# Altium schematic sheet Sheet5.SchDoc
size A3; DocumentNumber: 5; SheetNumber: 5; SheetTotal: 7
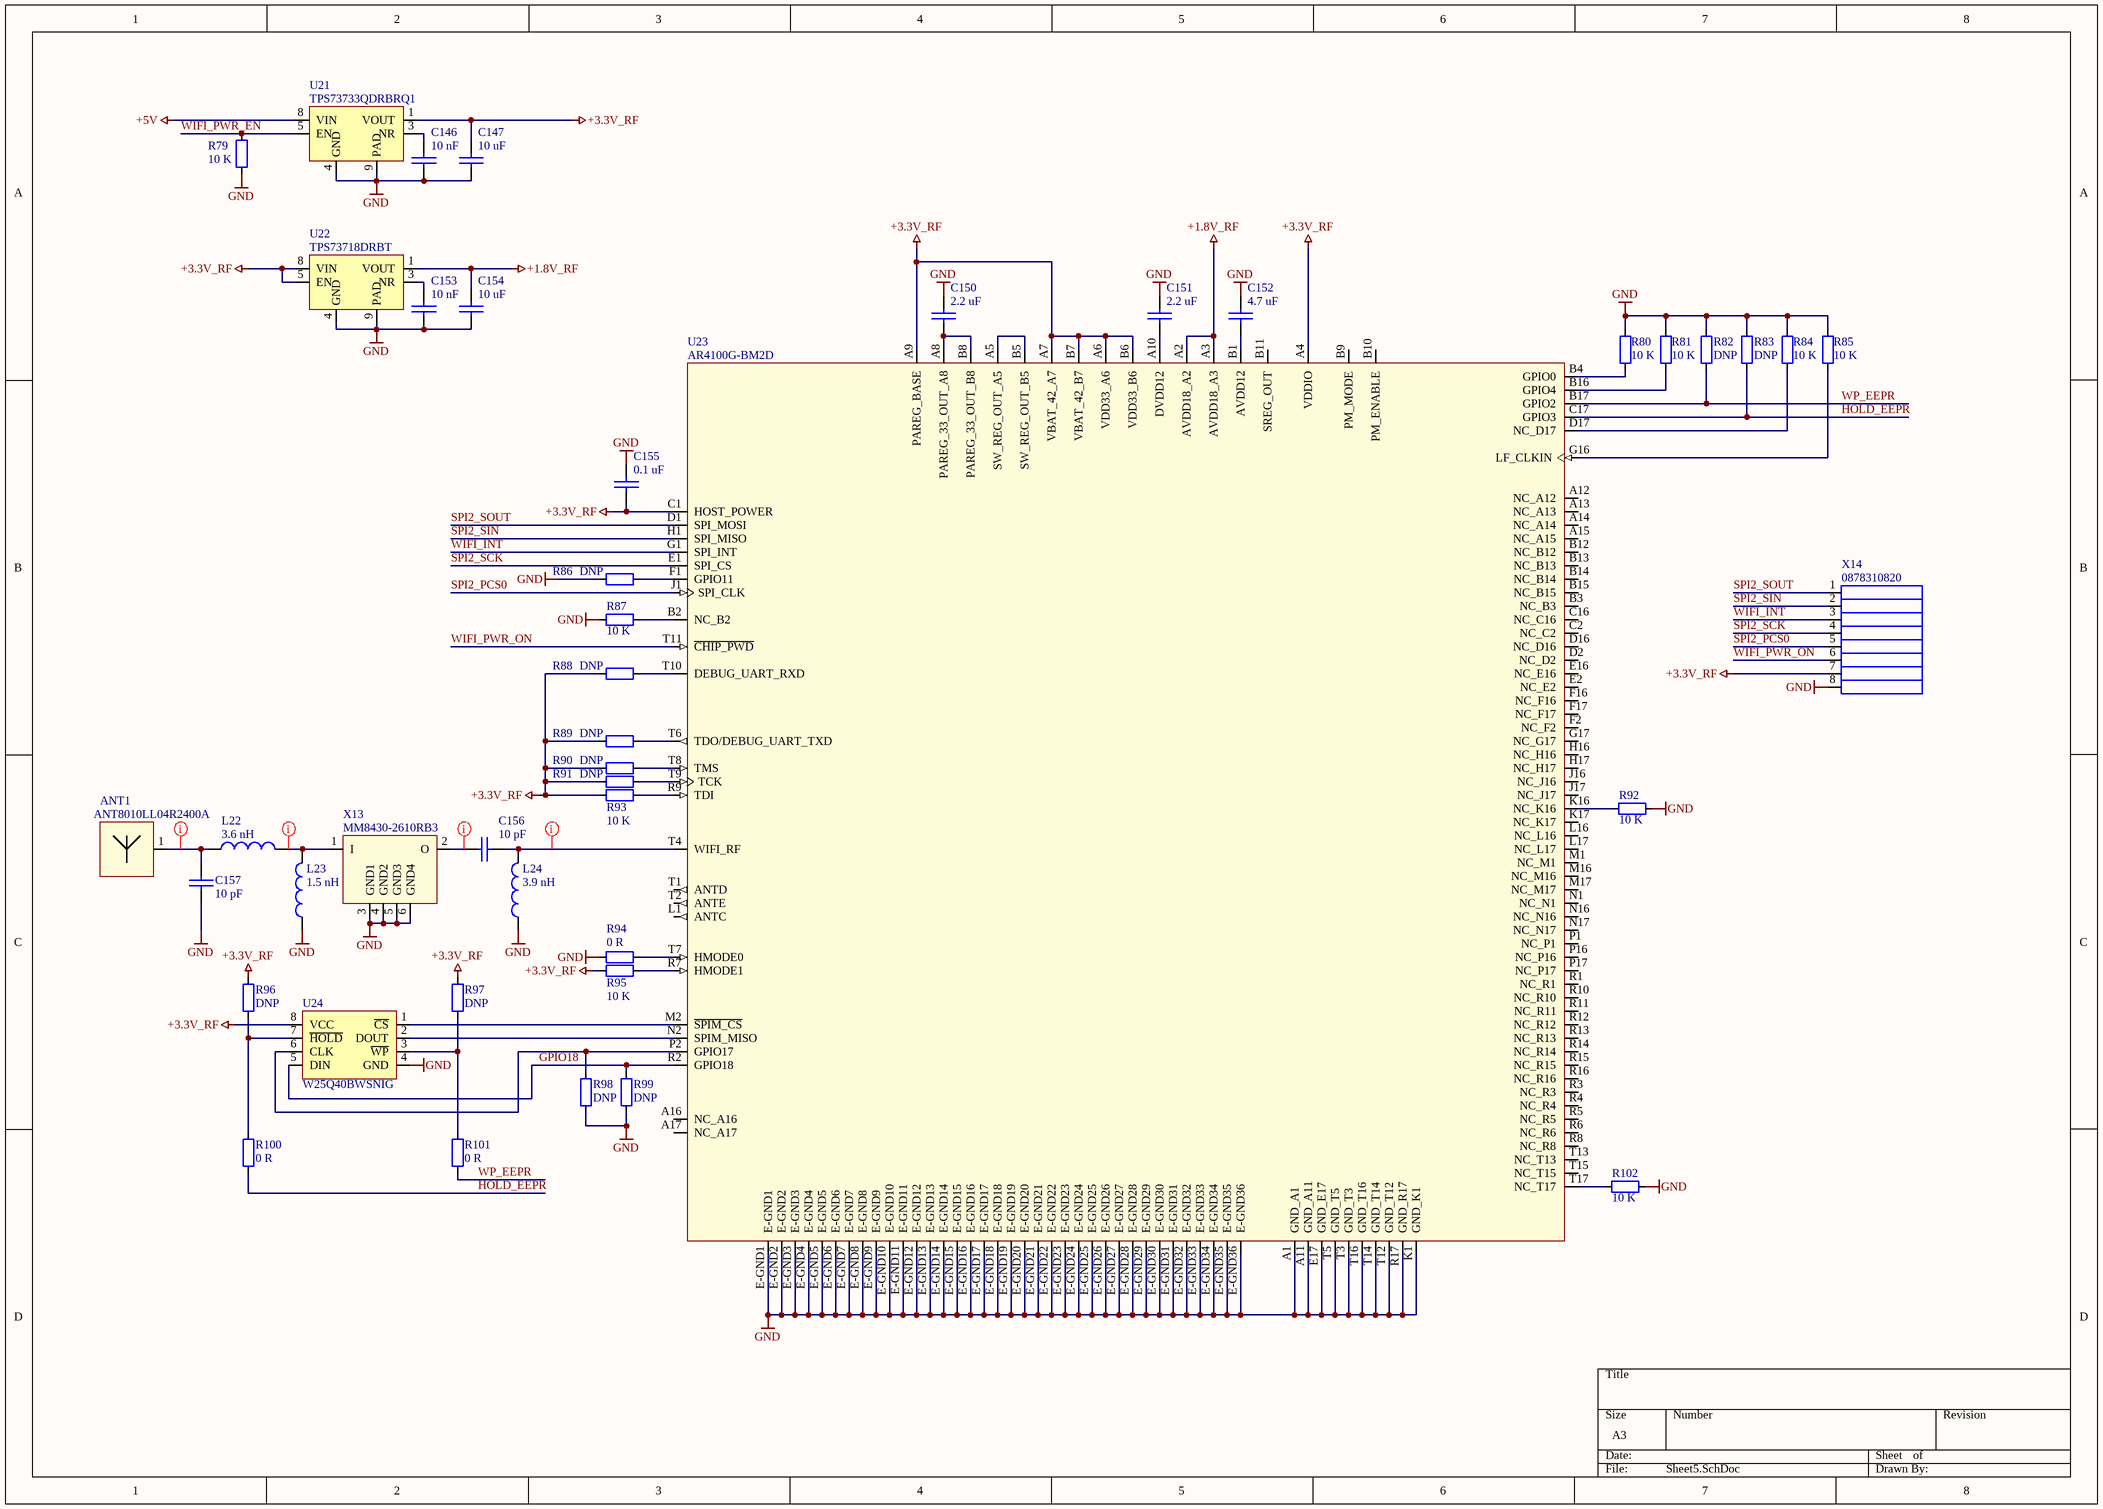
[diagram p0: Sheet5.SchDoc]

## Parts
ANT1  ANT8010LL04R2400A  [ANT8010LL04R2400A]
C146  value 10 nF  [1005[0402]]  (hidden comment: CL05B103KB5NNNC)
C147  value 10 uF  [2012[0805]]  (hidden comment: C2012X5R1C106K085AC)
C150  value 2.2 uF  [1005[0402]]  (hidden comment: C0402C225M9PACTU)
C151  value 2.2 uF  [1005[0402]]  (hidden comment: C0402C225M9PACTU)
C152  value 4.7 uF  [1608[0603]]  (hidden comment: LMK107BJ475KA-T)
C153  value 10 nF  [1005[0402]]  (hidden comment: CL05B103KB5NNNC)
C154  value 10 uF  [2012[0805]]  (hidden comment: CL05B104KO5NNNC)
C155  value 0.1 uF  [1005[0402]]  (hidden comment: CL05B104KO5NNNC)
C156  value 10 pF  [1005[0402]]  (hidden comment: GRM1555C1H100JZ01D)
C157  value 10 pF  [1005[0402]]  (hidden comment: GRM1555C1H100JZ01D)
L22  value 3.6 nH  [INDC1005-0402]  (hidden comment: LQP15MN3N6B02D)
L23  value 1.5 nH  [INDC1005-0402]  (hidden comment: LQP15MN1N5B02D)
L24  value 3.9 nH  [INDC1005-0402]  (hidden comment: LQP15MN3N9B02D)
R79  value 10 K  [0603]  (hidden comment: ERJ-3EKF1002V)
R80  value 10 K  [0402]  (hidden comment: ERJ-3EKF1002V)
R81  value 10 K  [0402]  (hidden comment: ERJ-3EKF1002V)
R82  value DNP  [0603]  (hidden comment: DNP_0603)  (no BOM)
R83  value DNP  [0603]  (hidden comment: DNP_0603)  (no BOM)
R84  value 10 K  [0402]  (hidden comment: ERJ-3EKF1002V)
R85  value 10 K  [0402]  (hidden comment: ERJ-3EKF1002V)
R86  value DNP  [0603]  (hidden comment: DNP_0603)  (no BOM)
R87  value 10 K  [0402]  (hidden comment: ERJ-3EKF1002V)
R88  value DNP  [0603]  (hidden comment: DNP_0603)  (no BOM)
R89  value DNP  [0603]  (hidden comment: DNP_0603)  (no BOM)
R90  value DNP  [0603]  (hidden comment: DNP_0603)  (no BOM)
R91  value DNP  [0603]  (hidden comment: DNP_0603)  (no BOM)
R92  value 10 K  [0402]  (hidden comment: ERJ-3EKF1002V)
R93  value 10 K  [0402]  (hidden comment: ERJ-3EKF1002V)
R94  value 0 R  [0603]  (hidden comment: RC0603JR-070RL)
R95  value 10 K  [0402]  (hidden comment: ERJ-3EKF1002V)
R96  value DNP  [0603]  (hidden comment: DNP_0603)  (no BOM)
R97  value DNP  [0603]  (hidden comment: DNP_0603)  (no BOM)
R98  value DNP  [0603]  (hidden comment: DNP_0603)  (no BOM)
R99  value DNP  [0603]  (hidden comment: DNP_0603)  (no BOM)
R100  value 0 R  [0603]  (hidden comment: RC0603JR-070RL)
R101  value 0 R  [0603]  (hidden comment: RC0603JR-070RL)
R102  value 10 K  [0402]  (hidden comment: ERJ-3EKF1002V)
U21  TPS73733QDRBRQ1  [TI DRB (S-PVSON-N8)]
U22  TPS73718DRBT  [TI DRB (S-PVSON-N8)]
U23  AR4100G-BM2D  [AR4100 BGA147]
U24  W25Q40BWSNIG  [SO-8]
X13  MM8430-2610RB3  [MM8430-2610RB3]
X14  0878310820  [0878310820 MGRID WALL HDR SMD]

## Nets
+1.8V_RF: C154.1 U22.1(VOUT) U23.A2(AVDD18_A2) U23.A3(AVDD18_A3)
+3.3V_RF: C147.2 C155.2 R88.2 R89.2 R90.2 R91.2 R93.2 R95.2 R96.2 R97.2 U21.1(VOUT) U22.5(EN) U22.8(VIN) U23.A4(VDDIO) U23.A6(VDD33_A6) U23.A7(VBAT_42_A7) U23.A9(PAREG_BASE) U23.B6(VDD33_B6) U23.B7(VBAT_42_B7) U23.C1(HOST_POWER) U24.8(VCC) X14.7
+5V: U21.8(VIN)
GND: C146.2 C147.1 C150.1 C151.1 C152.1 C153.2 C154.2 C155.1 C157.1 L23.1 L24.1 R79.2 R80.2 R81.2 R82.2 R83.2 R84.2 R85.2 R86.2 R87.2 R92.1 R94.2 R98.1 R99.1 R102.1 U21.4(GND) U21.9(PAD) U22.4(GND) U22.9(PAD) U23.A1(GND_A1) U23.A11(GND_A11) U23.E17(GND_E17) U23.E-GND1 U23.E-GND2 U23.E-GND3 U23.E-GND4 U23.E-GND5 U23.E-GND6 U23.E-GND7 U23.E-GND8 U23.E-GND9 U23.E-GND10 U23.E-GND11 U23.E-GND12 U23.E-GND13 U23.E-GND14 U23.E-GND15 U23.E-GND16 U23.E-GND17 U23.E-GND18 U23.E-GND19 U23.E-GND20 U23.E-GND21 U23.E-GND22 U23.E-GND23 U23.E-GND24 U23.E-GND25 U23.E-GND26 U23.E-GND27 U23.E-GND28 U23.E-GND29 U23.E-GND30 U23.E-GND31 U23.E-GND32 U23.E-GND33 U23.E-GND34 U23.E-GND35 U23.E-GND36 U23.K1(GND_K1) U23.R17(GND_R17) U23.T3(GND_T3) U23.T5(GND_T5) U23.T12(GND_T12) U23.T14(GND_T14) U23.T16(GND_T16) U24.4(GND) X13.3(GND1) X13.4(GND2) X13.5(GND3) X13.6(GND4) X14.8
GPIO18: R99.2 U23.R2(GPIO18) U24.5(DIN)
HOLD_EEPR: R83.1 R100.2 U23.C17(GPIO3)
SPI2_PCS0: U23.J1(SPI_CLK) X14.5
SPI2_SCK: U23.E1(SPI_CS) X14.4
SPI2_SIN: U23.H1(SPI_MISO) X14.2
SPI2_SOUT: U23.D1(SPI_MOSI) X14.1
WIFI_INT: U23.G1(SPI_INT) X14.3
WIFI_PWR_EN: R79.1 U21.5(EN)
WIFI_PWR_ON: U23.T11(~{CHIP_PWD}) X14.6
WP_EEPR: R82.1 R101.2 U23.B17(GPIO2)
NetANT1_1: ANT1.1(INPUT) C157.2 L22.1
NetC146_1: C146.1 U21.3(NR)
NetC150_2: C150.2 U23.A8(PAREG_33_OUT_A8) U23.B8(PAREG_33_OUT_B8)
NetC151_2: C151.2 U23.A10(DVDD12)
NetC152_2: C152.2 U23.B1(AVDD12)
NetC153_1: C153.1 U22.3(NR)
NetC156_1: C156.1 X13.2(O)
NetC156_2: C156.2 L24.2 U23.T4(WIFI_RF)
NetL22_2: L22.2 L23.2 X13.1(I)
NetR80_1: R80.1 U23.B4(GPIO0)
NetR81_1: R81.1 U23.B16(GPIO4)
NetR84_1: R84.1 U23.D17(NC_D17)
NetR85_1: R85.1 U23.G16(LF_CLKIN)
NetR86_1: R86.1 U23.F1(GPIO11)
NetR87_1: R87.1 U23.B2(NC_B2)
NetR88_1: R88.1 U23.T10(DEBUG_UART_RXD)
NetR89_1: R89.1 U23.T6(TDO/DEBUG_UART_TXD)
NetR90_1: R90.1 U23.T8(TMS)
NetR91_1: R91.1 U23.T9(TCK)
NetR92_2: R92.2 U23.K16(NC_K16)
NetR93_1: R93.1 U23.R9(TDI)
NetR94_1: R94.1 U23.T7(HMODE0)
NetR95_1: R95.1 U23.R7(HMODE1)
NetR96_1: R96.1 R100.1 U24.7(~{HOLD})
NetR97_1: R97.1 R101.1 U24.3(~{WP})
NetR98_2: R98.2 U23.P2(GPIO17) U24.6(CLK)
NetR102_2: R102.2 U23.T17(NC_T17)
NetU23_A5: U23.A5(SW_REG_OUT_A5) U23.B5(SW_REG_OUT_B5)
NetU23_M2: U23.M2(~{SPIM_CS}) U24.1(~{CS})
NetU23_N2: U23.N2(SPIM_MISO) U24.2(DOUT)

Not connected (* = marked no-connect by the designer): U23 A12(NC_A12) A13(NC_A13) A14(NC_A14) A15(NC_A15) A16(NC_A16) A17(NC_A17) B3(NC_B3) B9(PM_MODE) B10(PM_ENABLE) B11(SREG_OUT) B12(NC_B12) B13(NC_B13) B14(NC_B14) B15(NC_B15) C2(NC_C2) C16(NC_C16) D2(NC_D2) D16(NC_D16) E2(NC_E2) E16(NC_E16) F2(NC_F2) F16(NC_F16) F17(NC_F17) G17(NC_G17) H16(NC_H16) H17(NC_H17) J16(NC_J16) J17(NC_J17) K17(NC_K17) L1(ANTC) L16(NC_L16) L17(NC_L17) M1(NC_M1) M16(NC_M16) M17(NC_M17) N1(NC_N1) N16(NC_N16) N17(NC_N17) P1(NC_P1) P16(NC_P16) P17(NC_P17) R1(NC_R1) R3(NC_R3) R4(NC_R4) R5(NC_R5) R6(NC_R6) R8(NC_R8) R10(NC_R10) R11(NC_R11) R12(NC_R12) R13(NC_R13) R14(NC_R14) R15(NC_R15) R16(NC_R16) T1(ANTD) T2(ANTE) T13(NC_T13) T15(NC_T15)

## Layout directives
net class WIFI_ANT: NetANT1_1, NetC156_1, NetC156_2, NetL22_2

## Library data of the parts
ANT1 = ANT8010LL04R2400A: Chip ant. 2.4GHz ~ 2.5GHz, 5.5dBi; Manufacturer: Yageo; PartNum: 311-1550-1-ND; Distributor: Digi-Key; PartName: ANT8010LL04R2400A; Price: 1$
C146 C153 = GRM155R71C103KA01D_1: 10 nF, 16V, 10%, X7R, 0402; Manufacturer: SAMSUNG; Tolerance: 10%; Distributor: Future; Price: 0.02$; PartNum: CL05B103KB5NNNC; Voltage: 16 V; PartName: CL05B103KB5NNNC
C147 = C2012X5R1C106K/0.85: 10 uF, 16V, X5R, ±10%, 0805; Manufacturer: TDK Corporation; Distributor: Future; Price: 0.0347 Euro; Tolerance: ±10%; PartNum: C2012X5R1C106K085AC; Voltage: 16V; PartName: C2012X5R1C106K085AC; Price50: 0.0347 Euro; Price100: 0.0347 Euro; Price1000: 0.0347 Euro
C150 C151 = C0402C225M9PACTU: 2.2 uF, 6.3V, 20%, X5R, -55..85C, 0402; Manufacturer: SAMSUNG; PartNum: 399-7781-1-ND; Tolerance: 20%; Distributor: Future; Price: 0.22$; Voltage: 6.3 V; PartName: C0402C225M9PACTU
C152 = LMK107BJ475KA-T: 4.7 uF, 10V, 10%, X5R, 0603; Manufacturer: Taiyo Yuden; PartNum: 587-1441-1-ND; Tolerance: +-10%; Distributor: Digi-Key; Price: 0.23$; PartName: LMK107BJ475KA-T; Voltage: 10 V
C154 = C2012X5R1C106K/0.85: 10 uF, 16V, X5R, ±10%, 0805; Manufacturer: TDK Corporation; PartNum: 445-7644-1-ND; Tolerance: ±10%; Distributor: Digi-Key; Price: 0.15$; Voltage: 16V; PartName: C2012X5R1C106K/0.85
C155 = GRM155R71C104KA88D_1: 0.1 uF, 16V, 10%, X7R, 0402; Manufacturer: SAMSUNG; Tolerance: 10%; Distributor: Future; Price: 0.02$; PartNum: CL05B104KO5NNNC; Voltage: 16 V; PartName: CL05B104KO5NNNC
C156 C157 = GRM1555C1H100JZ01D: 10 pF, 50V, 5%, NP0/COG, 0402; Manufacturer: Murata; Tolerance: 5%; Price: 0.01$; Distributor: Mouser
L22 = LQP15MN3N6B02D: 3.6 nH, ±0.1nH, 170 мА, 0402; Manufacturer: Murata; PartNum: 490-6756-1-ND; Tolerance: ±0.1nH; Price: 0.18$; Distributor: Digi-Key; PartName: LQP15MN3N6B02D
L23 = LQP15MN1N5B02D: 1.5 nH, ±0.1nH, 280 мА, 0402; Manufacturer: Murata; PartNum: 490-1126-1-ND; Tolerance: ±0.1nH; Price: 0.18$; Distributor: Digi-Key; PartName: LQP15MN1N5B02D
L24 = LQP15MN3N9B02D: 3.9 nH, ±0.1nH, 170 мА, 0402; Manufacturer: Murata; PartNum: 490-1131-1-ND; Tolerance: ±0.1nH; Price: 0.18$; Distributor: Digi-Key; PartName: LQP15MN3N9B02D
R79 = RL0603K010-1: 10 K, 1%, 0603, SMD Resistor, Taped; Manufacturer: PANASONIC; Voltage: 75 V; Distributor: Future; Price: 0.0015 Euro; Tolerance: 1%; PartNum: ERJ-3EKF1002V; PartName: ERJ-3EKF1002V; Price50: 0.0015 Euro; Price100: 0.0015 Euro; Price1000: 0.0015 Euro
R80 R81 R84 R85 R87 R92 R93 R95 R102 = RC0402JR-0710KL: 10 K, 5%, 0402, SMD Resistor, Taped; Manufacturer: Yageo; PartNum: 311-10KJRCT-ND; Voltage: 75 V; Distributor: Digi-Key; Price: 0.1$; Tolerance: 5%; PartName: RC0402JR-0710KL
R82 R83 R86 R88-R91 R96-R99 = DNP_0603: DNP, 0603
R94 R100 R101 = RL0603E000: 0 R, 5%, 0603, SMD Resistor, Taped; Manufacturer: YAGEO AMERICA CORPORATION; Voltage: 75 V; Distributor: Future; Price: 0.0017$; Tolerance: 5%; PartNum: RC0603JR-070RL; PartName: RC0603JR-070RL; Price50: 0.0017$; Price100: 0.0017$; Price1000: 0.0017$
U21 = TPS73733QDRBRQ1: LDO 3.3V 1A , up to 5.5 V, -40..125C,  8-SON; Manufacturer: Texas Instruments; PartNum: 296-24157-1-ND; Price: 2$; Distributor: Digi-Key; PartName: TPS73733QDRBRQ1
U22 = TPS73718DRBT: LDO 1.8V 1A , 2.2..5.5 V, -40..125C,  8-SON; Manufacturer: Texas Instruments; PartNum: 296-28932-1-ND; Price: 2$; Distributor: Digi-Key; PartName: TPS73718DRBT
U23 = AR4100G-BM2D: Atheros single-stream 802.11n system-in-package Wi-Fi-System; Manufacturer: Qualcomm; Distributor: Future; PartName: AR4100G-BM2D; PartNum: AR4100G-BM2D; Price: 8.6$
U24 = W25Q40BWSNIG: FLASH 4MBIT 80MHZ,  1.65..1.95V, -40..85C, 8SOIC; Manufacturer: Winbond Electronics; PartNum: W25Q40BWSNIG-ND; Price: 0.63$; Distributor: Digi-Key; PartName: W25Q40BWSNIG
X13 = MM8430-2610RB3: ONN SWD JACK STR 50 OHM SMD; Manufacturer: Murata Electronics North America; PartNum: 490-8451-6-ND; Distributor: Digi-Key; PartName: MM8430-2610RB3; Price: 1.15$
X14 = 0878310820: CONN HEADER 8POS 2MM VERT GOLD; Manufacturer: Molex Inc; PartNum: WM18559-ND; Distributor: Digi-Key; Price: 0.85$; PartName: 0878310820